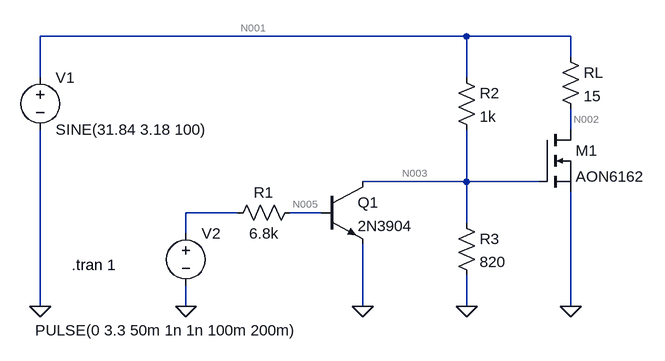
[diagram p0: schematic FusibleElectronico.asc]
FusibleElectronico.asc, the LTspice schematic file:
Version 4
SHEET 1 1472 680
WIRE 768 80 112 80
WIRE 928 80 768 80
WIRE 928 112 928 80
WIRE 112 144 112 80
WIRE 768 144 768 80
WIRE 928 224 928 192
WIRE 768 304 768 224
WIRE 768 304 608 304
WIRE 880 304 768 304
WIRE 416 352 336 352
WIRE 544 352 496 352
WIRE 768 368 768 304
WIRE 336 384 336 352
WIRE 112 496 112 224
WIRE 336 496 336 464
WIRE 608 496 608 400
WIRE 768 496 768 448
WIRE 928 496 928 320
FLAG 112 496 0
FLAG 928 496 0
FLAG 336 496 0
FLAG 608 496 0
FLAG 768 496 0
SYMBOL voltage 112 128 R0
WINDOW 123 0 0 Left 0
WINDOW 39 0 0 Left 0
SYMATTR InstName V1
SYMATTR Value SINE(31.84 3.18 100)
SYMBOL res 912 96 R0
SYMATTR InstName RL
SYMATTR Value 15
SYMBOL voltage 336 368 R0
WINDOW 3 -232 165 Left 2
WINDOW 123 0 0 Left 0
WINDOW 39 0 0 Left 0
SYMATTR Value PULSE(0 3.3 50m 1n 1n 100m 200m)
SYMATTR InstName V2
SYMBOL nmos 880 224 R0
SYMATTR InstName M1
SYMATTR Value AON6162
SYMBOL res 512 336 R90
WINDOW 0 0 56 VBottom 2
WINDOW 3 32 56 VTop 2
SYMATTR InstName R1
SYMATTR Value 6.8k
SYMBOL npn 544 304 R0
SYMATTR InstName Q1
SYMATTR Value 2N3904
SYMBOL res 752 128 R0
SYMATTR InstName R2
SYMATTR Value 1k
SYMBOL res 752 352 R0
SYMATTR InstName R3
SYMATTR Value 820
TEXT 160 432 Left 2 !.tran 1

The netlist it stands for:
* FusibleElectronico.asc
V1 N001 0 SINE(31.84 3.18 100)
RL N001 N002 15
V2 N004 0 PULSE(0 3.3 50m 1n 1n 100m 200m)
M1 N002 N003 0 0 AON6162
R1 N005 N004 6.8k
Q1 N003 N005 0 0 2N3904
R2 N001 N003 1k
R3 N003 0 820
.model NPN NPN
.model PNP PNP
.lib standard.bjt
.model NMOS NMOS
.model PMOS PMOS
.lib standard.mos
.tran 1
.backanno
.end

* Results of the author's LTspice run, read from the files saved beside the schematic
* Operating Point, zero values left out:
*   V(n001) = 31.84 V
*   V(n002) = 2.142 mV
*   V(n003) = 14.35 V
*   V(n005) = 97.57 nV
*   Ic(Q1) = 14.35 pA
*   Ib(Q1) = -14.35 pA
*   Id(M1) = 2.123 A
*   Is(M1) = -2.123 A
*   I(Rl) = 2.123 A
*   I(R1) = 14.35 pA
*   I(R2) = 17.49 mA
*   I(R3) = 17.49 mA
*   I(V1) = -2.14 A
*   I(V2) = 14.35 pA
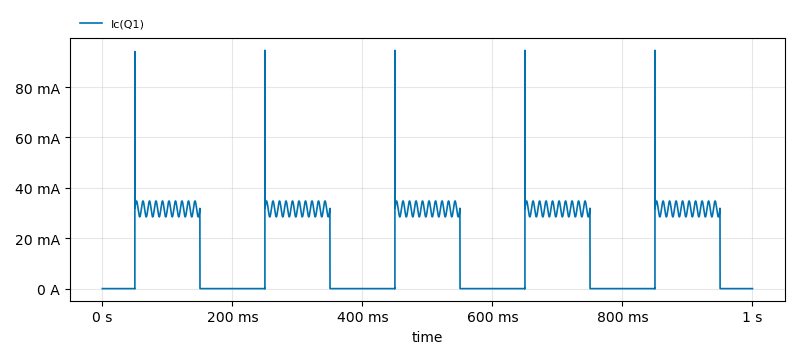
[diagram p1: Transient Analysis of FusibleElectronico.asc, plotted from the saved traces]
* Transient Analysis, 1 run:
*   Ic(Q1): min -75.64 µA, max 94.54 mA, average 15.81 mA, rms 22.42 mA, last 0 A